# Altium schematic sheet Esquematico.SchDoc
size A4
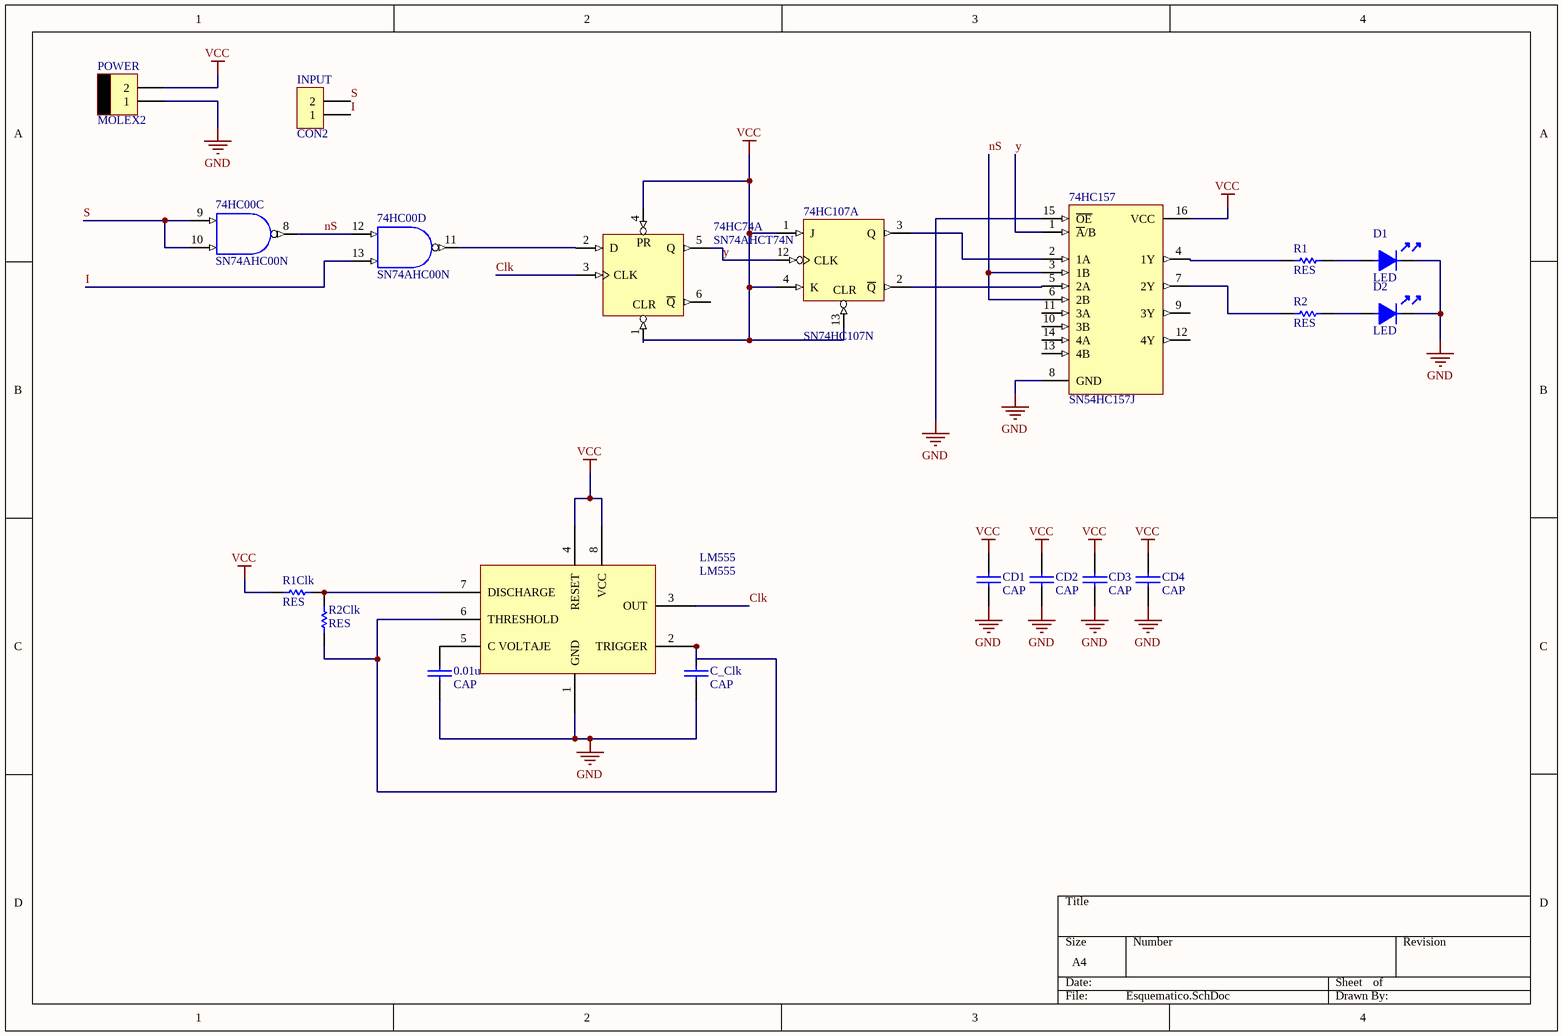
[diagram p0: Esquematico.SchDoc]

## Parts
0.01u  CAP  [CAP200]
74HC00  SN74AHC00N  [N014]  (parts C,D of 4)
74HC74  SN74AHCT74N  [N014]  (part A of 2)
74HC107  SN74HC107N  [N014D]  (part A of 2)
74HC157  SN54HC157J  [J016]
C_Clk  CAP  [CAP200]
CD1  CAP  [CAP200]
CD2  CAP  [CAP200]
CD3  CAP  [CAP200]
CD4  CAP  [CAP200]
D1  LED  [LED3]
D2  LED  [LED3]
INPUT  CON2  [SIP2]
LM555  LM555  [DIP8]
POWER  MOLEX2  [MOLEX2]
R1  RES  [RES400]
R1Clk  RES  [RES400]
R2  RES  [RES400]
R2Clk  RES  [RES400]

## Nets
GND: 0.01u.2 74HC00.7(GND) 74HC74.7(GND) 74HC107.7(GND) 74HC157.8(GND) 74HC157.15(~{OE}) C_Clk.2 CD1.2 CD2.2 CD3.2 CD4.2 D1.2 D2.2 LM555.1(GND) POWER.1
VCC: 74HC00.14(VCC) 74HC74.1(CLR) 74HC74.4(PR) 74HC74.14(VCC) 74HC107.1(J) 74HC107.4(K) 74HC107.13(CLR) 74HC107.14(VCC) 74HC157.16(VCC) CD1.1 CD2.1 CD3.1 CD4.1 LM555.4(RESET) LM555.8(VCC) POWER.2 R1Clk.1
Clk: 74HC74.3(CLK) LM555.3(OUT)
I: 74HC00.13(B) INPUT.1
nS: 74HC00.8(Y) 74HC00.12(A) 74HC157.3(1B) 74HC157.6(2B)
S: 74HC00.9(A) 74HC00.10(B) INPUT.2
y: 74HC74.5(Q) 74HC107.12(CLK) 74HC157.1(~{A}/B)
Net0.01u_1: 0.01u.1 LM555.5(C_VOLTAJE)
Net74HC00_11: 74HC00.11(Y) 74HC74.2(D)
Net74HC107_2: 74HC107.2(~{Q}) 74HC157.5(2A)
Net74HC107_3: 74HC107.3(Q) 74HC157.2(1A)
Net74HC157_4: 74HC157.4(1Y) R1.1
Net74HC157_7: 74HC157.7(2Y) R2.1
NetC_Clk_1: C_Clk.1 LM555.2(TRIGGER) LM555.6(THRESHOLD) R2Clk.1
NetD1_1: D1.1 R1.2
NetD2_1: D2.1 R2.2
NetLM555_7: LM555.7(DISCHARGE) R1Clk.2 R2Clk.2

Not connected (* = marked no-connect by the designer): 74HC74 6(~{Q}); 74HC157 9(3Y) 10(3B) 11(3A) 12(4Y) 13(4B) 14(4A)

## Library data of the parts
74HC00 = SN74AHC00N: Quadruple 2-Input Positive-NAND Gate; Published: 8-Jun-2000; LatestRevisionDate: 04-Mar-2005; LatestRevisionNote: Stylized 3D Model Added.; DatasheetVersion: Jun-1998; PackageVersion: Oct-1995; PackageReference: N014; Publisher: Altium Limited; PackageDescription: DIP; 14 Leads; Row Spacing 7.62 mm; Pitch 2.54 mm; ComponentLink1Description: Manufacturer Link; ComponentLink1URL: http://www.ti.com/; ComponentLink2Description: Datasheet; ComponentLink2URL: http://www-s.ti.com/sc/ds/sn74ahc00.pdf; ComponentLink3Description: Packaging Specification; ComponentLink3URL: http://focus.ti.com/lit/ml/mpdi002c/mpdi002c.pdf
74HC74 = SN74AHCT74N: Dual Positive-Edge-Triggered D-Type Flip-Flop with Clear and Preset; Published: 8-Jun-2000; LatestRevisionDate: 04-Mar-2005; LatestRevisionNote: Stylized 3D Model Added.; DatasheetVersion: Oct-1998; PackageVersion: Oct-1995; PackageReference: N014; Publisher: Altium Limited; PackageDescription: DIP; 14 Leads; Row Spacing 7.62 mm; Pitch 2.54 mm; ComponentLink1Description: Manufacturer Link; ComponentLink1URL: http://www.ti.com/; ComponentLink2Description: Datasheet; ComponentLink2URL: http://www-s.ti.com/sc/ds/sn74ahct74.pdf
74HC107 = SN74HC107N: Dual J-K Negative-Edge-Triggered Flip-Flop with Clear; Published: 8-Jun-2000; LatestRevisionDate: 04-Mar-2005; LatestRevisionNote: Stylized 3D Model Added.; DatasheetVersion: Jun-1989; PackageVersion: Oct-1995; PackageReference: N014D; Publisher: Altium Limited; PackageDescription: DIP; 14 Leads; Row Spacing 7.62 mm; Pitch 2.54 mm; ComponentLink1Description: Manufacturer Link; ComponentLink1URL: http://www.ti.com/
74HC157 = SN54HC157J: Quadraple 2-Line to 1-Line Data Selector/Multiplexer; Published: 8-Jun-2000; LatestRevisionDate: 04-Mar-2005; LatestRevisionNote: Stylized 3D Model Added.; DatasheetVersion: May-1997; PackageVersion: Jun-1999; PackageReference: J016; Publisher: Altium Limited; PackageDescription: DIP; 16 Leads; Row Spacing 7.62 mm; Pitch 2.54 mm; ComponentLink1Description: Manufacturer Link; ComponentLink1URL: http://www.ti.com/; ComponentLink2Description: Datasheet; ComponentLink2URL: http://www-s.ti.com/sc/ds/sn74hc157.pdf
LM555 = LM555: Timer